# EAGLE design joysticks (EAGLE 6.6.0)
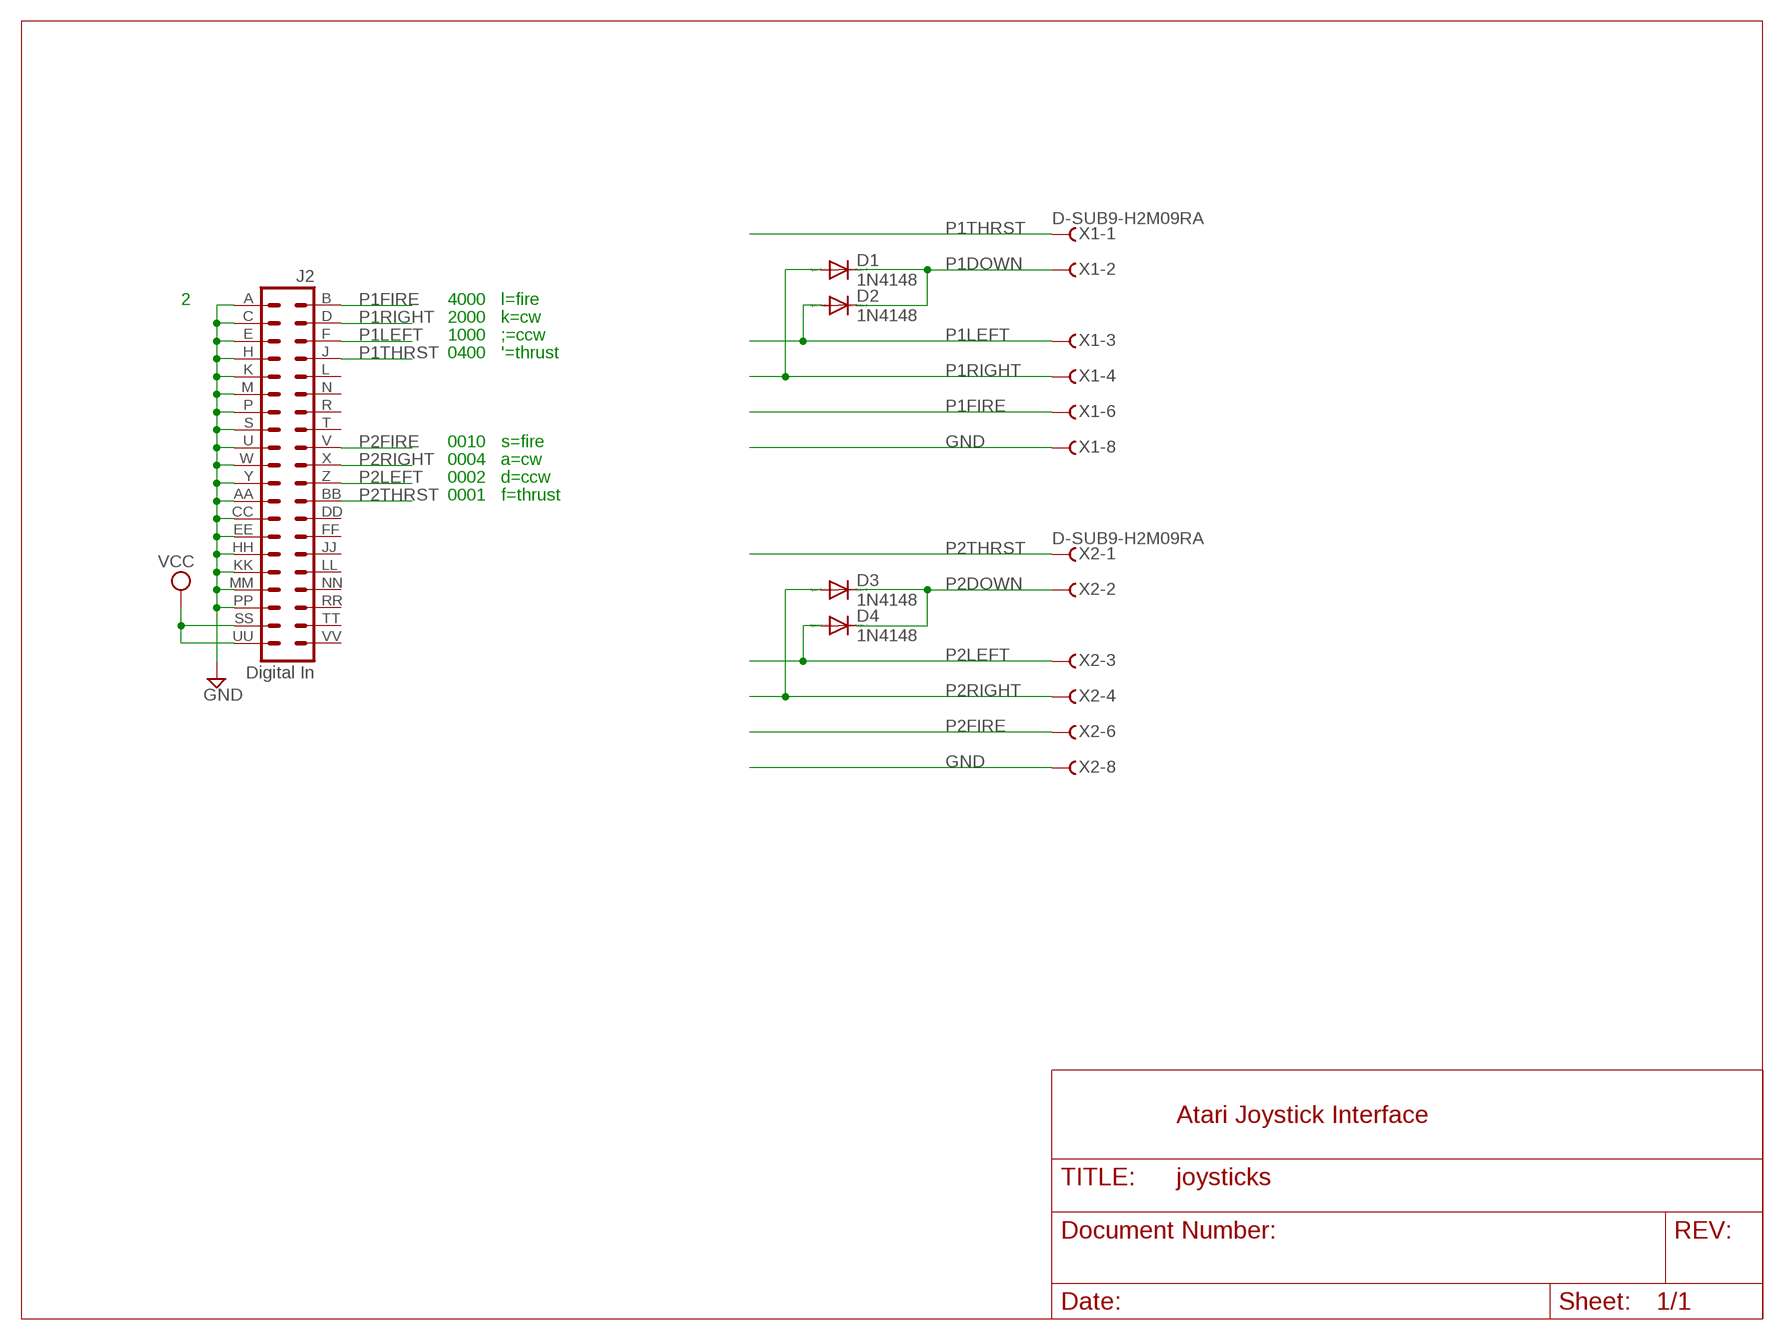
[diagram p0: schematic, sheet 1]

## Parts
D1  1N4148  DIODE-DO35-10  [DO35-10]
D2  1N4148  DIODE-DO35-10  [DO35-10]
D3  1N4148  DIODE-DO35-10  [DO35-10]
D4  1N4148  DIODE-DO35-10  [DO35-10]
J2  Digital In  DEC40PINH  [DEC40PINH]
X1  D-SUB9-H2M09RA  [H2M09RA]
X2  D-SUB9-H2M09RA  [H2M09RA]

## Nets
GND [supply]: J2.A J2.AA J2.C J2.CC J2.E J2.EE J2.H J2.HH J2.K J2.KK J2.M J2.MM J2.P J2.PP J2.S J2.U J2.W J2.Y X1.8 X2.8
P1DOWN: D1.C D2.C X1.2
P1FIRE: J2.B X1.6
P1LEFT: D2.A J2.F X1.3
P1RIGHT: D1.A J2.D X1.4
P1THRST: J2.J X1.1
P2DOWN: D3.C D4.C X2.2
P2FIRE: J2.V X2.6
P2LEFT: D4.A J2.Z X2.3
P2RIGHT: D3.A J2.X X2.4
P2THRST: J2.BB X2.1
VCC [supply]: J2.SS J2.UU
Unconnected: J2.DD J2.FF J2.JJ J2.L J2.LL J2.N J2.NN J2.R J2.RR J2.T J2.TT J2.VV X1.5 X1.7 X1.9 X2.5 X2.7 X2.9

## Notes on the sheet
- 2 | 4000 | l=fire
- 2000 | k=cw
- 1000 | ;=ccw
- 0400 | '=thrust
- 0010 | s=fire
- 0004 | a=cw
- 0002 | d=ccw
- 0001 | f=thrust
- Atari Joystick Interface

## Library data of the parts
D1-D4 = diode:DIODE-: DIODE
J2 = dec-con:DEC40PIN: PIN HEADER
X1 X2 = con-thomas-betts:D-SUB9-: D-Subminiatur Connector Source: Electronioc Interconnects European Edition 1998; OC_FARNELL: unknown; OC_NEWARK: unknown

## Net classes
1 supply: width 0.61 mm

## Board
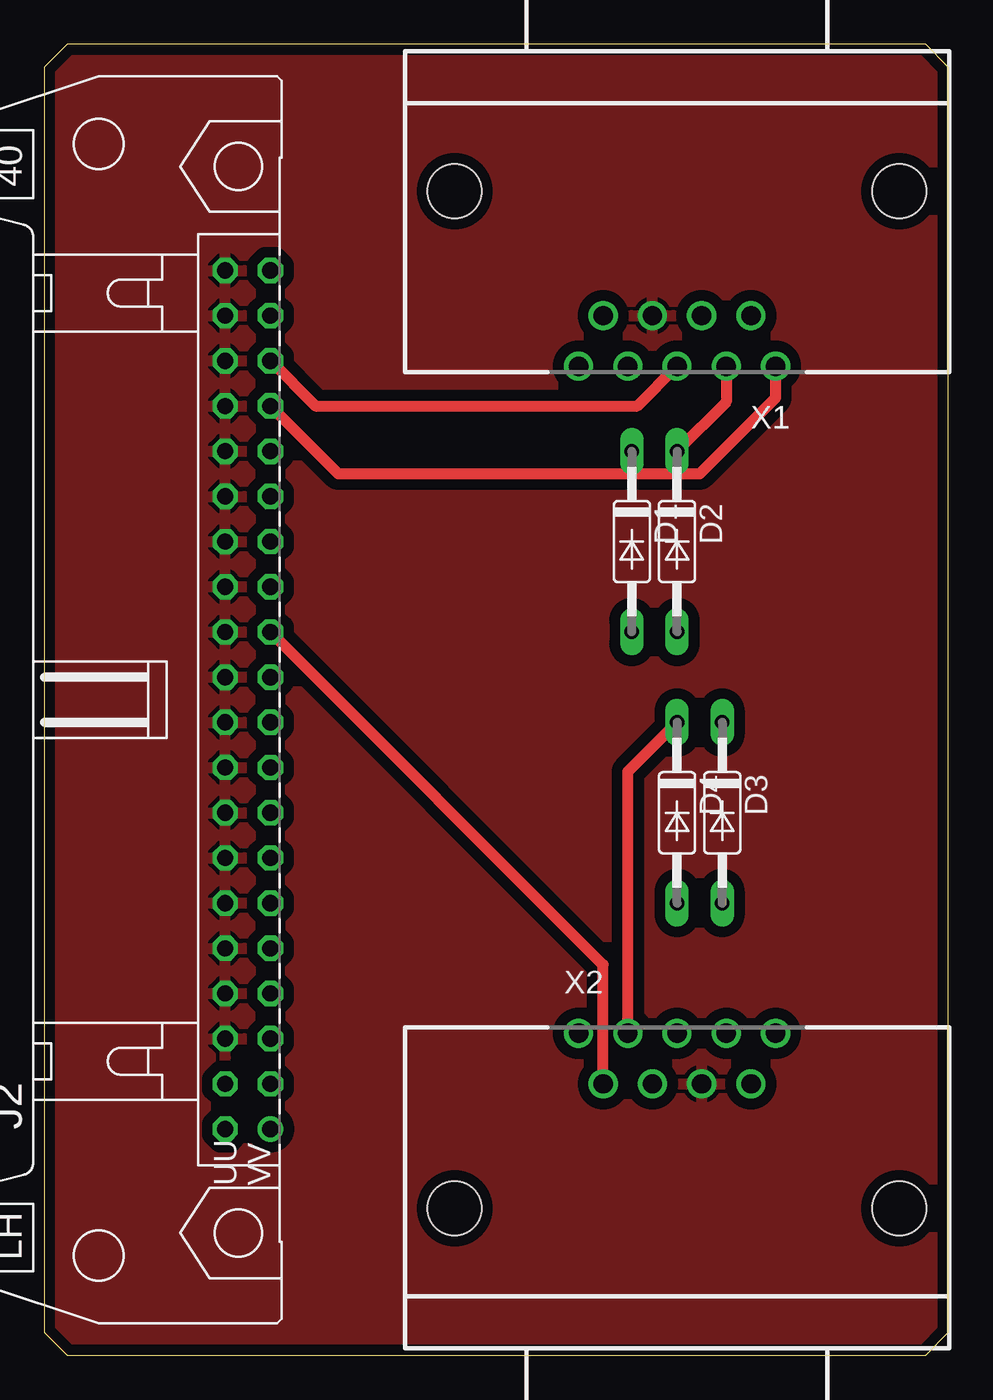
[diagram p1: board, top side]
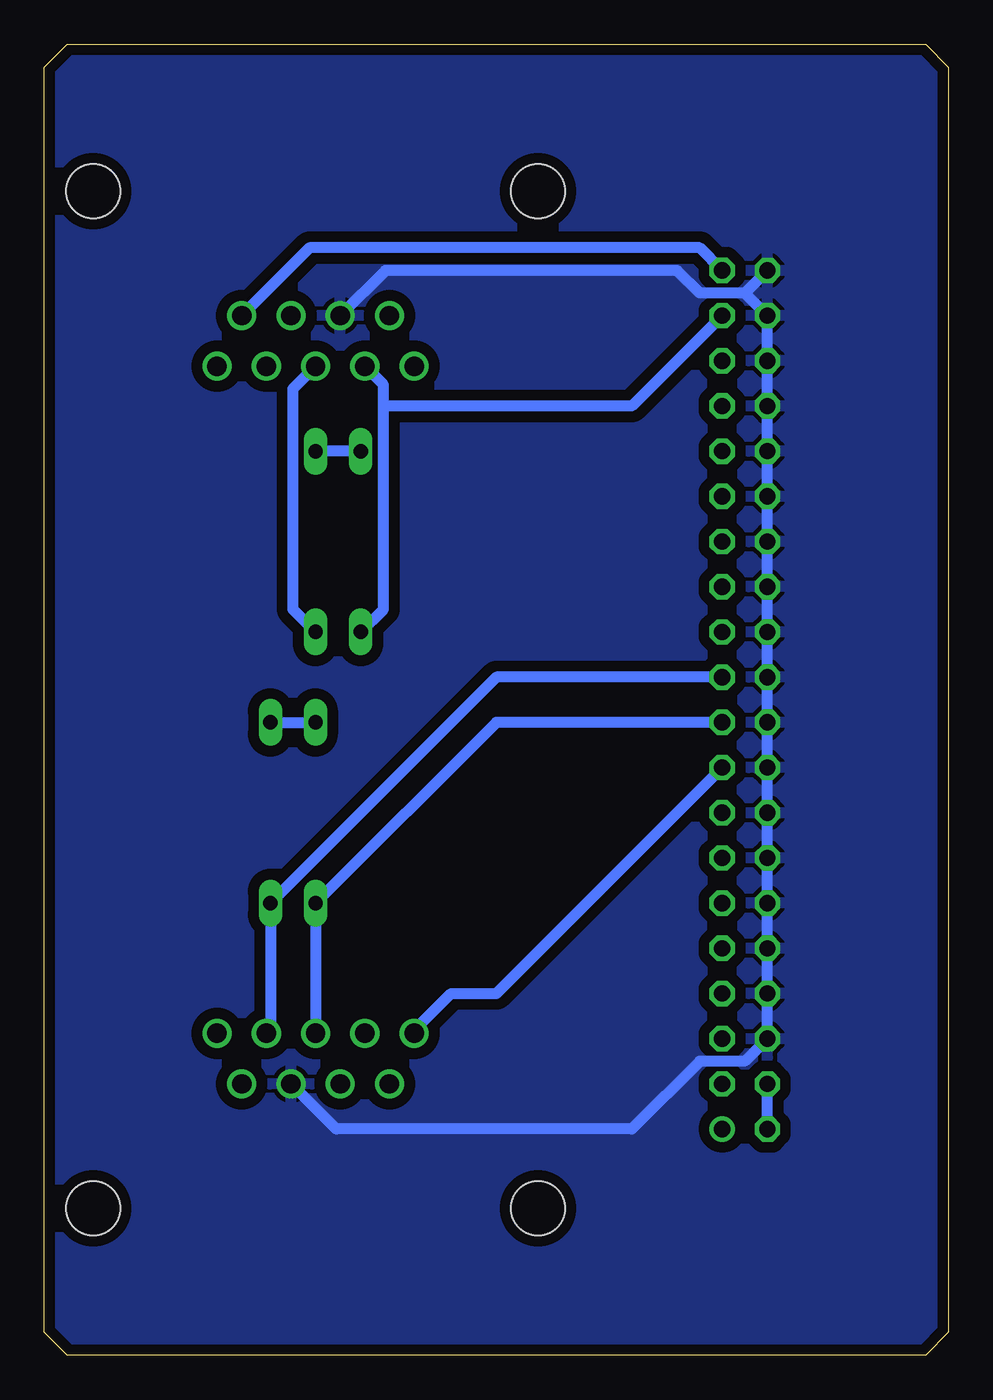
[diagram p2: board, bottom side, seen from below]

Size 50.8 x 73.66 mm. Coordinates in mm from the lower left corner, seen from the top.
Outline: 0,1.27 1.27,0 49.53,0 50.8,1.27 50.8,72.39 49.53,73.66 1.27,73.66 0,72.39 0,1.27
Copper layers (1+16): Top 0.035mm / dielectric 1.5mm / Bottom 0.035mm
Design rules "16mils": minimum track width 16mil, minimum drill 32mil, track to track 15mil, track to pad 10mil, pad to pad 10mil, via to via 10mil, smd to smd 10mil, copper to edge 13mil, drill to drill 10mil, minimum pad ring 10mil, minimum via ring 8mil, stop-mask expansion 0mil, vias tented up to drill 0mil, thermal gap 10mil

### Footprints (pad centres in the part's own frame; a part is rotated, then mirrored left to right if it is on the bottom)
DO35-10 = drill 0.813 long: A 5.08,0; C -5.08,0
DEC40PINH = drill 0.914 octagon: A 24.13,1.27; AA -3.81,1.27; B 24.13,-1.27; BB -3.81,-1.27; C 21.59,1.27; CC -6.35,1.27; D 21.59,-1.27; DD -6.35,-1.27; E 19.05,1.27; EE -8.89,1.27; F 19.05,-1.27; FF -8.89,-1.27; H 16.51,1.27; HH -11.43,1.27; J 16.51,-1.27; JJ -11.43,-1.27; K 13.97,1.27; KK -13.97,1.27; L 13.97,-1.27; LL -13.97,-1.27; M 11.43,1.27; MM -16.51,1.27; N 11.43,-1.27; NN -16.51,-1.27; P 8.89,1.27; PP -19.05,1.27; R 8.89,-1.27; RR -19.05,-1.27; S 6.35,1.27; SS -21.59,1.27; T 6.35,-1.27; TT -21.59,-1.27; U 3.81,1.27; UU -24.13,1.27; V 3.81,-1.27; W 1.27,1.27; X 1.27,-1.27; Y -1.27,1.27; Z -1.27,-1.27 | drill 0.914: VV -24.13,-1.27
H2M09RA = drill 1.092: 1 -5.537,7.925; 2 -2.769,7.925; 3 0,7.925; 4 2.769,7.925; 5 5.537,7.925; 6 -4.153,5.08; 7 -1.384,5.08; 8 1.384,5.08; 9 4.153,5.08 | hole 3.048: -12.497,-1.905; 12.497,-1.905

### Placement (x,y rotation side)
D1  33.02,45.72 270 top
D2  35.56,45.72 270 top
D3  38.1,30.48 270 top
D4  35.56,30.48 270 top
J2  11.43,36.83 90 top
X1  35.56,63.5 180 top
X2  35.56,10.16 0 top

### Tracks (layer width: path | path; a pad name or v marks a point on that pad's centre or on a via)
GND
  Bottom 0.61: J2.A 11.43,59.69 | 11.43,59.69 13.97,59.69 15.24,60.96 31.64,60.96 X1.8 | 11.43,59.69 J2.C J2.E J2.H J2.K J2.M J2.P J2.S J2.U J2.W J2.Y J2.AA J2.CC J2.EE J2.HH J2.KK J2.MM J2.PP 11.43,16.51 13.97,16.51 17.78,12.7 34.4,12.7 X2.8
  pour Bottom (isolate 0.61): 0,73.66 50.8,73.66 50.8,0 0,0
  pour Top (isolate 0.61): 0,73.66 50.8,73.66 50.8,0 0,0
P1DOWN
  Top 0.61: X1.2 38.33,53.57 D2.C
  Bottom 0.61: D1.C D2.C
P1FIRE
  Bottom 0.61: J2.B 13.97,62.23 35.9,62.23 X1.6
P1LEFT
  Top 0.61: J2.F 15.24,53.34 33.33,53.34 X1.3
  Bottom 0.61: D2.A 36.83,41.91 36.83,54.3 X1.3
P1RIGHT
  Bottom 0.61: D1.A 31.75,41.91 31.75,53.34 | 31.75,53.34 31.75,54.53 X1.4 | J2.D 17.78,53.34 31.75,53.34
P1THRST
  Top 0.61: J2.J 16.51,49.53 36.83,49.53 41.1,53.8 X1.1
P2DOWN
  Top 0.61: X2.2 32.79,32.79 D4.C
  Bottom 0.61: D3.C D4.C
P2FIRE
  Top 0.61: J2.V 31.41,21.93 X2.6
P2LEFT
  Bottom 0.61: X2.3 D4.A 25.4,35.56 J2.Z
P2RIGHT
  Bottom 0.61: X2.4 38.1,18.31 D3.A 25.4,38.1 J2.X
P2THRST
  Bottom 0.61: X2.1 30.02,18.24 27.94,20.32 25.4,20.32 J2.BB
VCC
  Bottom 0.61: J2.UU J2.SS